# EasyEDA schematic SCH_Power-Controller.json
TITLE: Mainboard; REV: 1.0; Date: 2025-03-14; Sheet: 1/1; Drawn By: danny-andersen; Company: Danny A inc
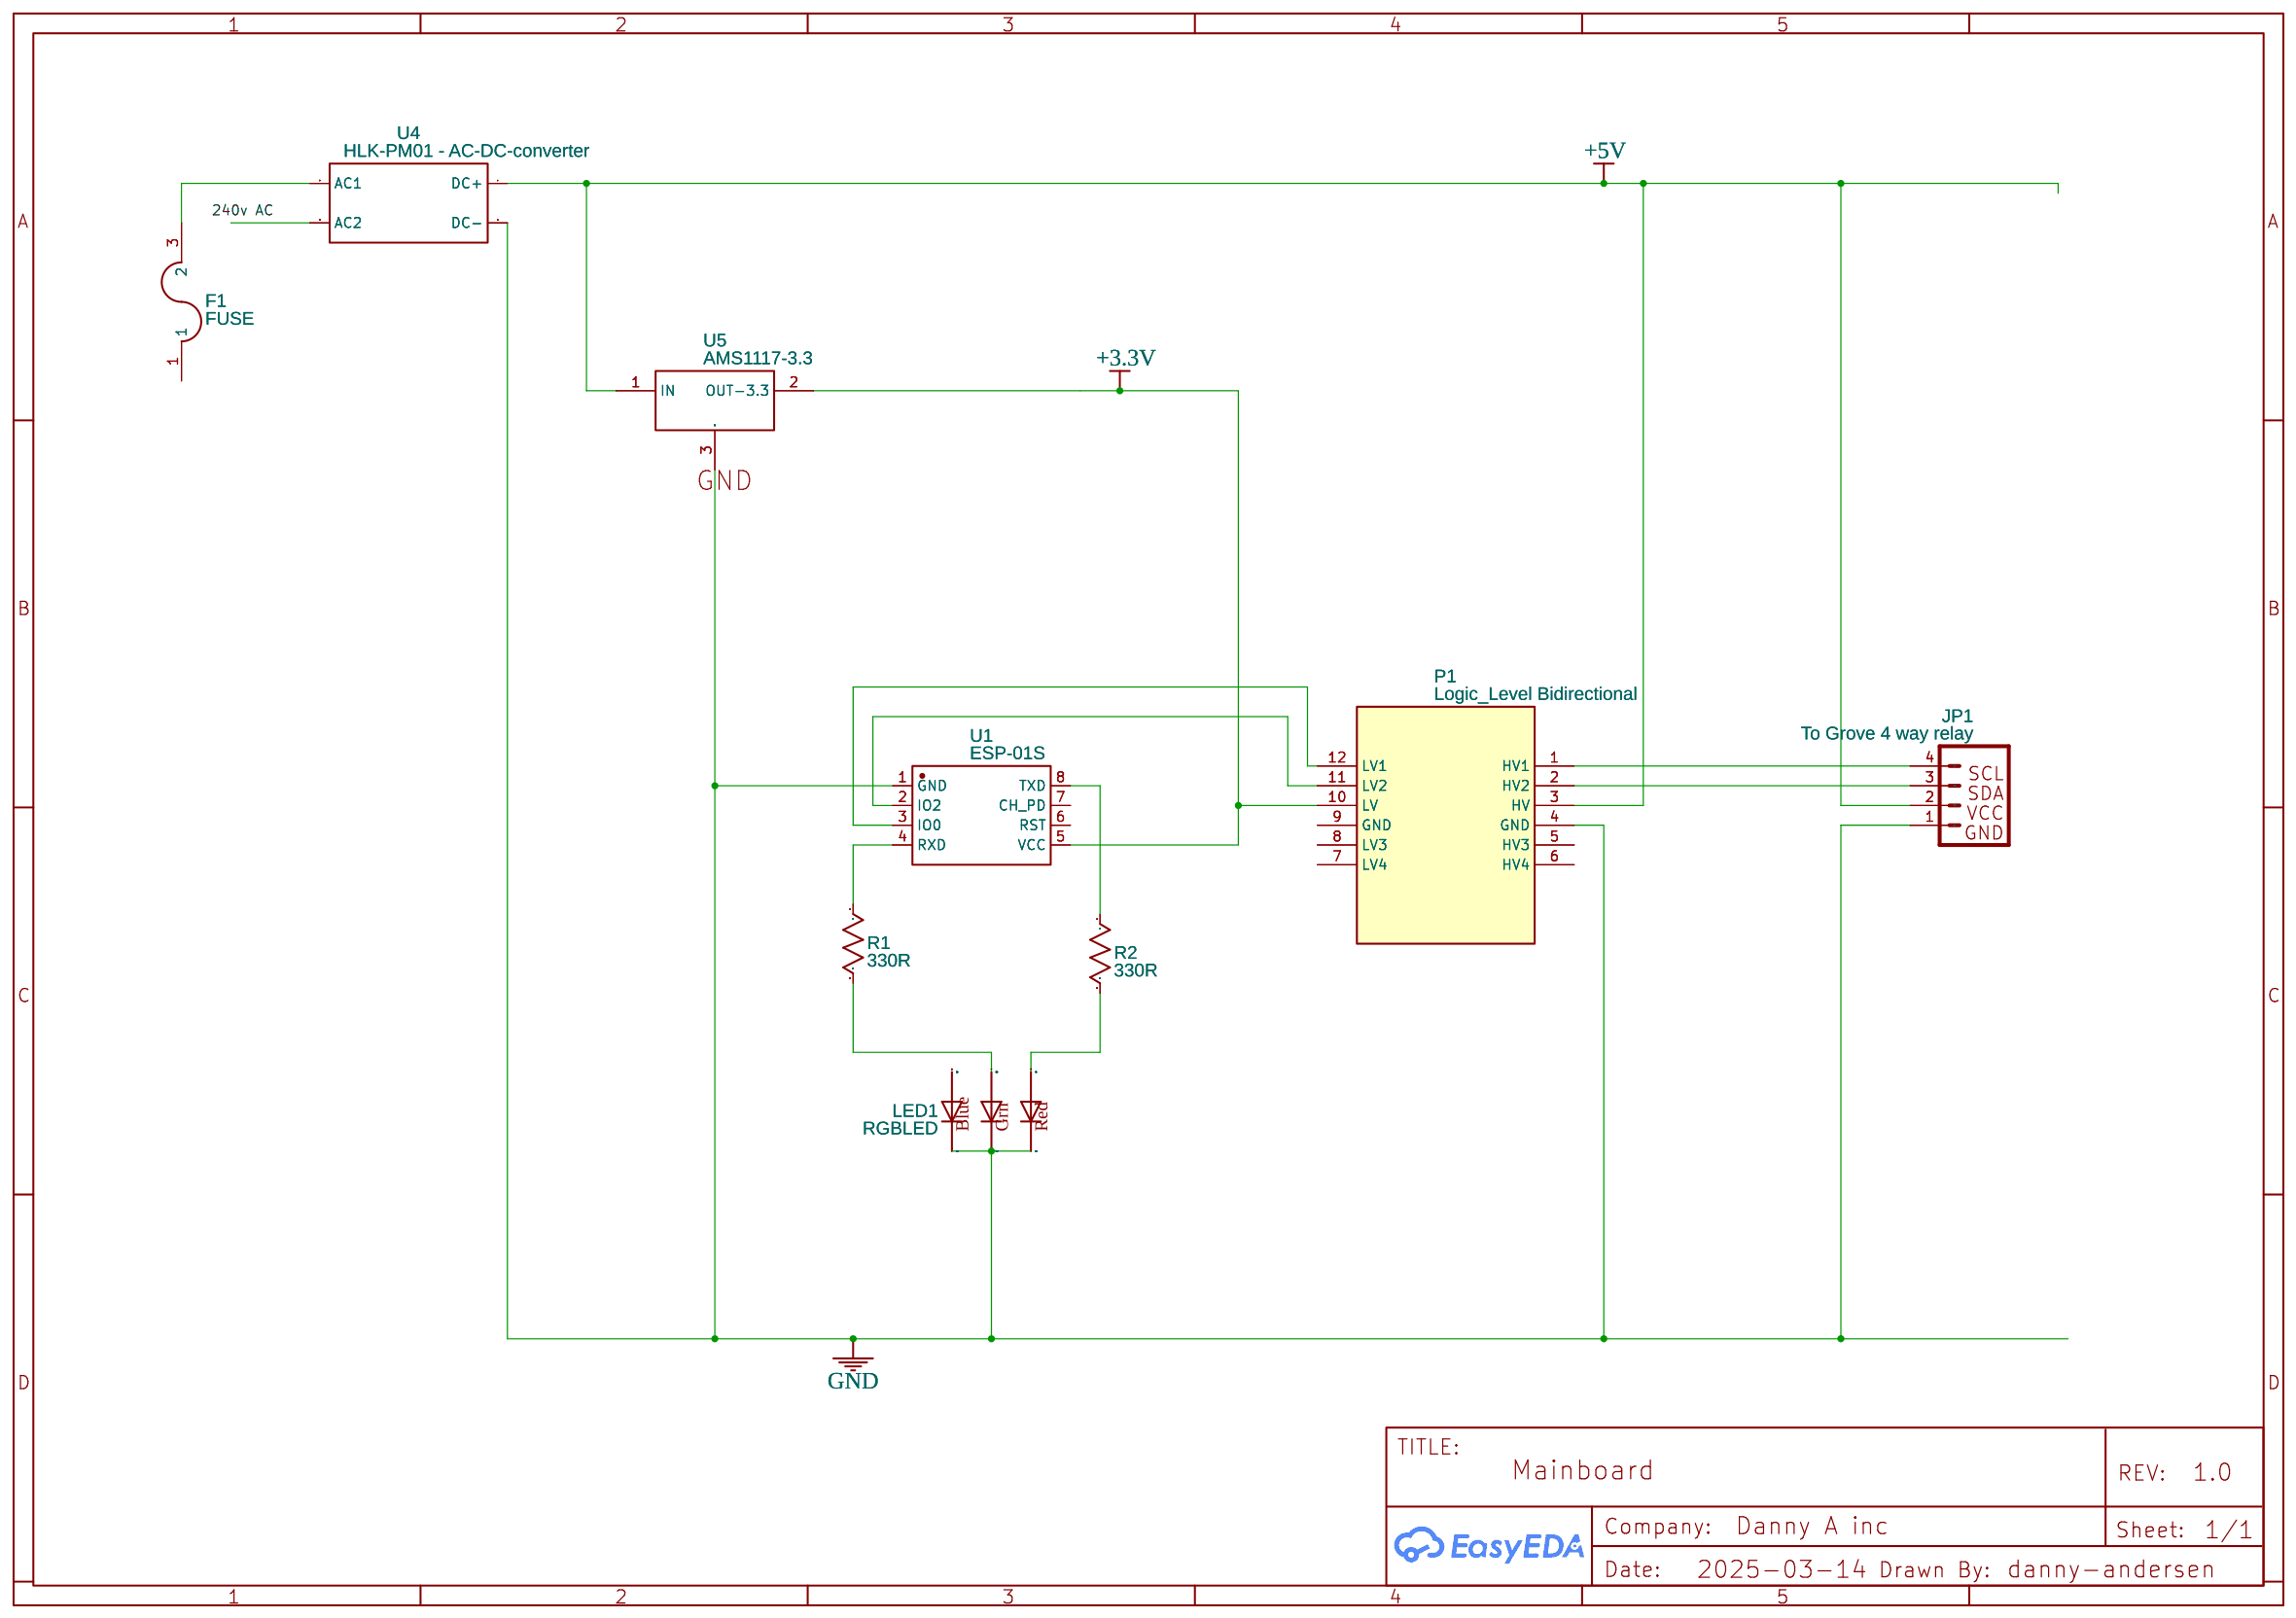
[diagram p0: schematic sheet]

## Parts
F1  FUSE  [FUSE_5MM]
JP1  To Grove 4 way relay  [1X04]
LED1  RGBLED  [RGBLED5050]
P1  Logic_Level Bidirectional  [LOGIC_LEVEL BIDIRECTIONAL]
R1  330R  [R0603]
R2  330R  [R0603]
U1  ESP-01S  [WIFIM-TH_ESP-01S]
U4  HLK-PM01 - AC-DC-converter  [HLK-PM01]
U5  AMS1117-3.3  [SOT-89-3_L4.5-W2.5-P1.50-LS4.2-BR]

## Library data of the parts
F1 = -: catid: 20; Contributor: SparkFun; Manufacturer Part: ?
JP1 = I2C_STANDARD: SparkFun has standardized on a pinout for all I2C based sensor breakouts.; Contributor: SparkFun
LED1 = RGBLED: Contributor: Adafruit
P1 = Logic_Level Bidirectional: sourceId: ldJDwO6oi
R1 R2 = R_0603_US: Contributor: LCEDA_Lib
U1 = ESP-01S: Supplier: LCSC; Manufacturer: Ai-Thinker; Supplier Part: C111009; JLCPCB Part Class: Extended Part
U4 = -: catid: 20; sourceId: u1BzxTRca; Manufacturer Part: ?
U5 = 7805(SOT-89): Supplier: LCSC; Manufacturer: CJ; Manufacturer Part: CJ78L05; image: //image.lceda.cn/szlcsc/C2079.jpg; Supplier Part: C2079; Paste Type: expand; Contributor: LCEDA_Lib

## Nets
+3.3V: P1.10(LV) U1.5(VCC) U5.2(OUT-3.3)
+5V: JP1.2 P1.3(HV) U4.4(DC+) U5.1(IN)
GND: JP1.1 LED1.4(BLUE_C) LED1.5(RED_C) LED1.6(GREEN_C) P1.4(GND) U1.1(GND) U4.3(DC-) U5.3(GND)
Net-(F1-3): F1.3(2) U4.1(AC1)
Net-(JP1-3): JP1.3 P1.2(HV2)
Net-(JP1-4): JP1.4 P1.1(HV1)
Net-(LED1-1): LED1.1(GREEN_A) R1.2
Net-(LED1-2): LED1.2(RED_A) R2.2
Net-(P1-11): P1.11(LV2) U1.2(IO2)
Net-(P1-12): P1.12(LV1) U1.3(IO0)
Net-(R1-1): R1.1 U1.4(RXD)
Net-(R2-1): R2.1 U1.8(TXD)

Not connected (* = marked no-connect by the designer): F1 1; LED1 3(BLUE_A); P1 5(HV3) 6(HV4) 7(LV4) 8(LV3) 9(GND); U1 6(RST) 7(CH_PD); U4 2(AC2)
